# Altium schematic sheet 03_MOS_Drive.SchDoc
size A3
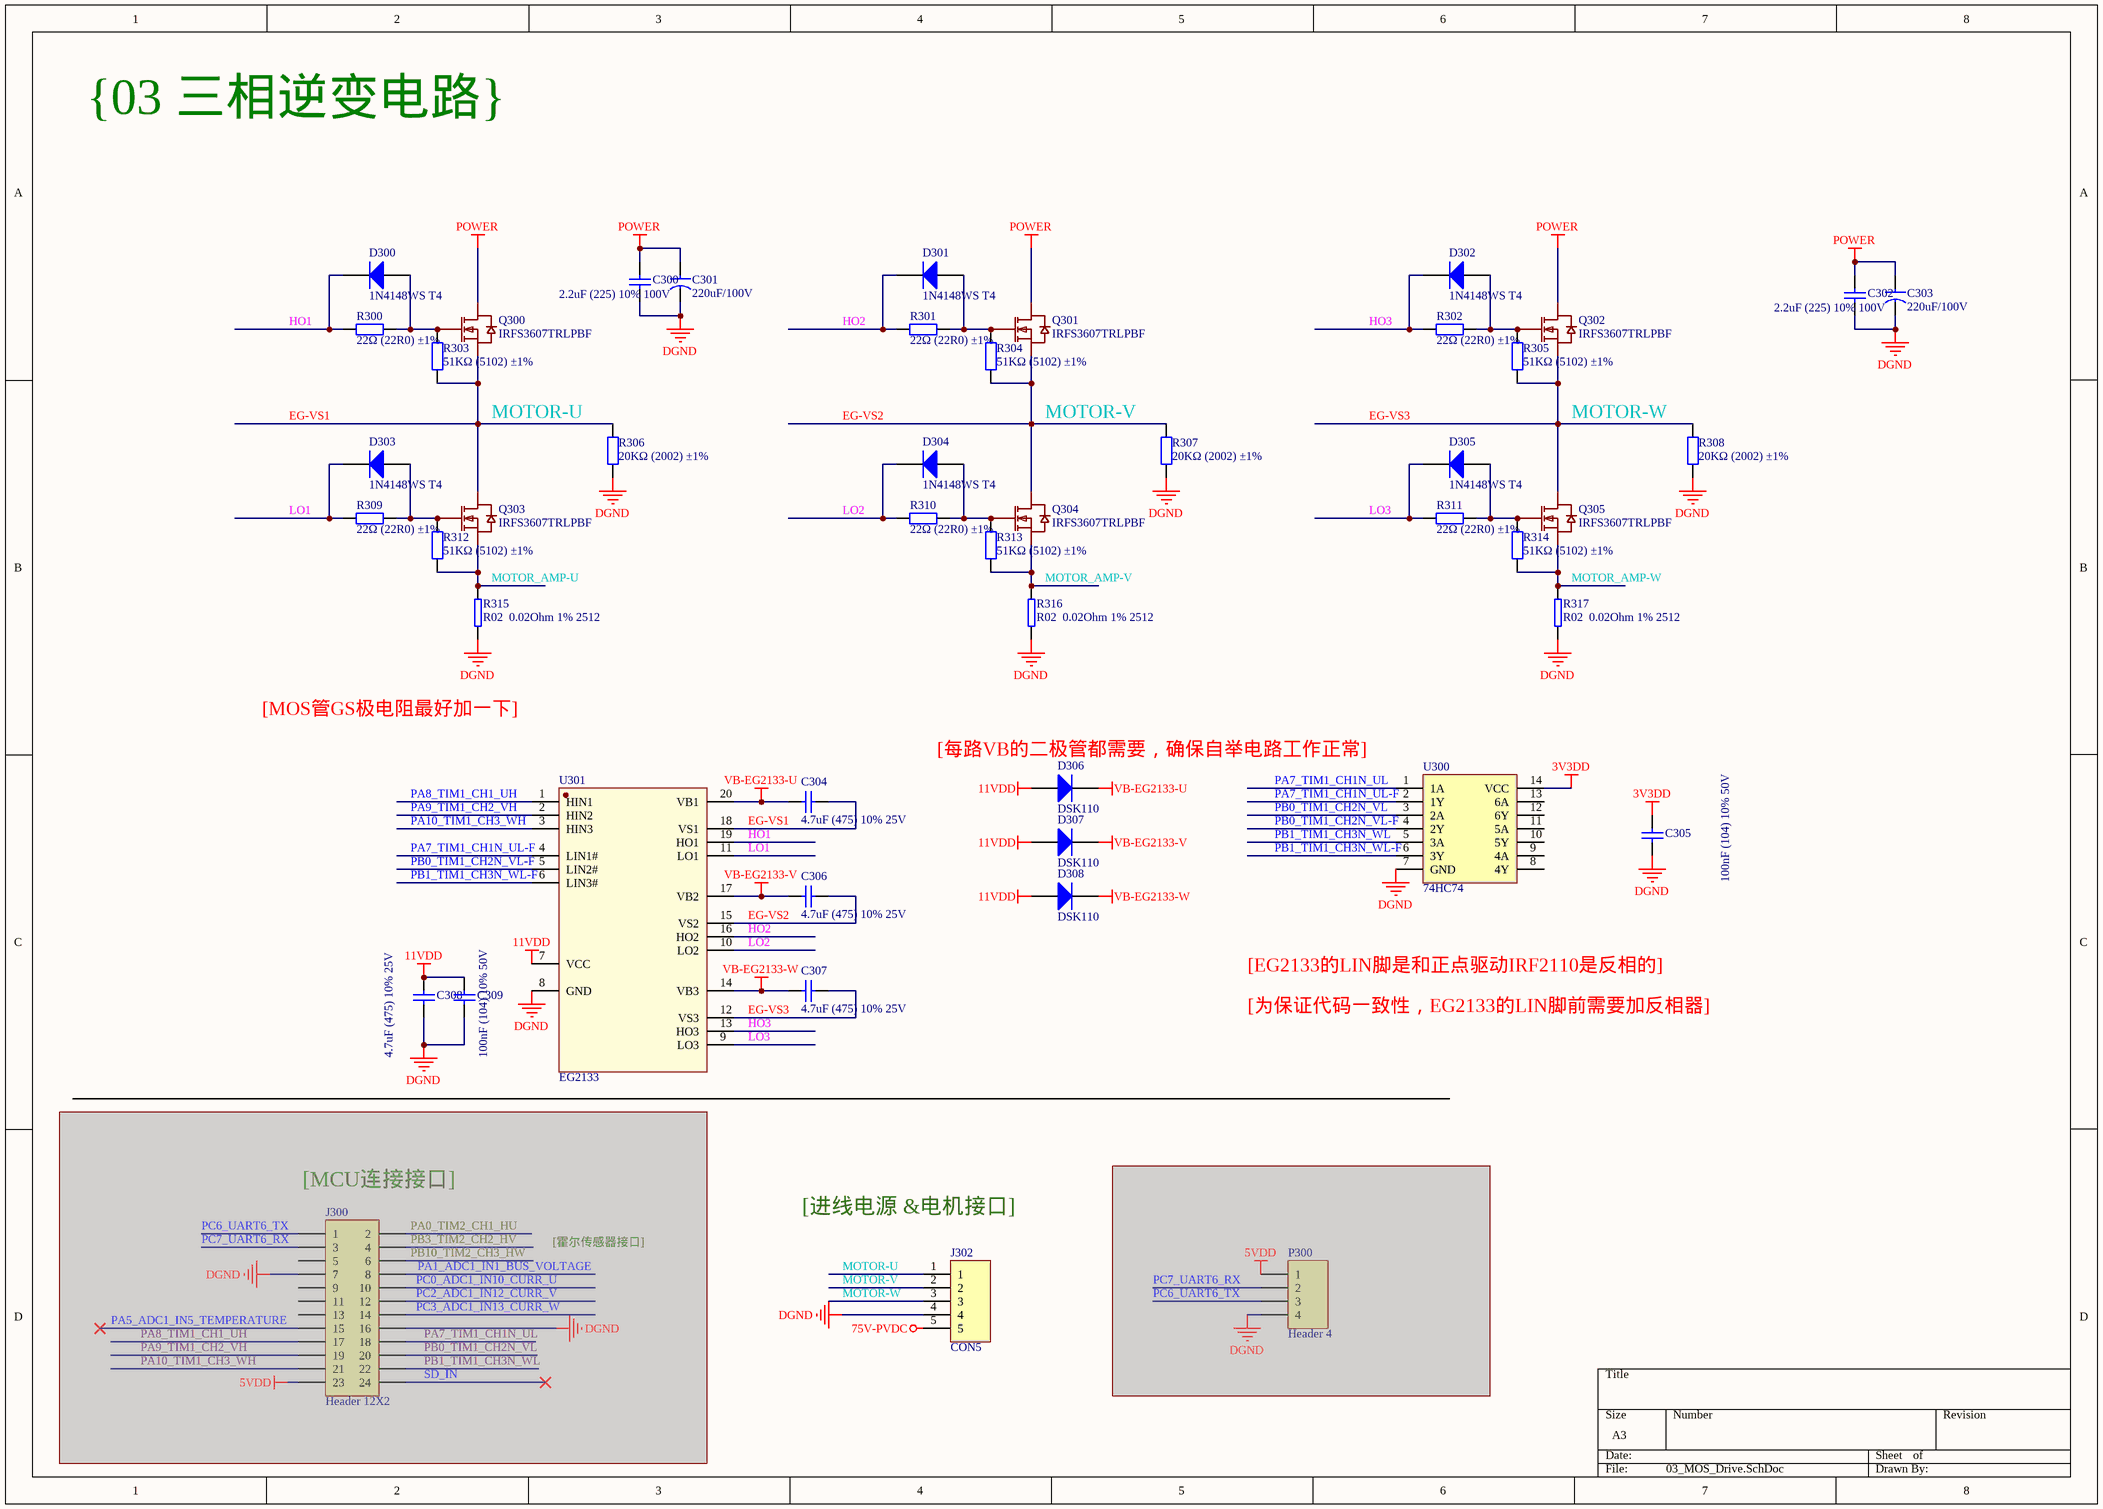
[diagram p0: 03_MOS_Drive.SchDoc]

## Parts
C300  2.2uF (225) 10% 100V  [LC-1206_C]
C301  220uF/100V  [220UF/100V]
C302  2.2uF (225) 10% 100V  [LC-1206_C]
C303  220uF/100V  [220UF/100V]
C304  4.7uF (475) 10% 25V  [LC-0805_C]
C305  100nF (104) 10% 50V  [LC-0603_C]
C306  4.7uF (475) 10% 25V  [LC-0805_C]
C307  4.7uF (475) 10% 25V  [LC-0805_C]
C308  4.7uF (475) 10% 25V  [LC-0603_C]
C309  100nF (104) 10% 50V  [LC-0603_C]
D300  1N4148WS T4  [LC-SOD-323]
D301  1N4148WS T4  [LC-SOD-323]
D302  1N4148WS T4  [LC-SOD-323]
D303  1N4148WS T4  [LC-SOD-323]
D304  1N4148WS T4  [LC-SOD-323]
D305  1N4148WS T4  [LC-SOD-323]
D306  DSK110  [DSK110]
D307  DSK110  [DSK110]
D308  DSK110  [DSK110]
J300  Header 12X2  [HDR2X12]  (masked out: inside a compile mask, not in the netlist)
J302  CON5  [7.62-5P 端子]
P300  Header 4  [HDR1X4]  (masked out: inside a compile mask, not in the netlist)
Q300  IRFS3607TRLPBF  [TO-263-2]
Q301  IRFS3607TRLPBF  [TO-263-2]
Q302  IRFS3607TRLPBF  [TO-263-2]
Q303  IRFS3607TRLPBF  [TO-263-2]
Q304  IRFS3607TRLPBF  [TO-263-2]
Q305  IRFS3607TRLPBF  [TO-263-2]
R300  22Ω (22R0) ±1%  [LC-0603_R]
R301  22Ω (22R0) ±1%  [LC-0603_R]
R302  22Ω (22R0) ±1%  [LC-0603_R]
R303  51KΩ (5102) ±1%  [LC-0603_R]
R304  51KΩ (5102) ±1%  [LC-0603_R]
R305  51KΩ (5102) ±1%  [LC-0603_R]
R306  20KΩ (2002) ±1%  [LC-0603_R]
R307  20KΩ (2002) ±1%  [LC-0603_R]
R308  20KΩ (2002) ±1%  [LC-0603_R]
R309  22Ω (22R0) ±1%  [LC-0603_R]
R310  22Ω (22R0) ±1%  [LC-0603_R]
R311  22Ω (22R0) ±1%  [LC-0603_R]
R312  51KΩ (5102) ±1%  [LC-0603_R]
R313  51KΩ (5102) ±1%  [LC-0603_R]
R314  51KΩ (5102) ±1%  [LC-0603_R]
R315  R02  0.02Ohm 1% 2512  [R2512]
R316  R02  0.02Ohm 1% 2512  [R2512]
R317  R02  0.02Ohm 1% 2512  [R2512]
U300  74HC74  [SOIC-14]
U301  EG2133  [TSSOP20]

## Nets
3V3DD: C305.2 U300.14(VCC)
11VDD: C308.2 C309.2 D306.2(A) D307.2(A) D308.2(A) U301.7(VCC)
75V-PVDC: J302.5
DGND: C300.2 C301.2 C302.2 C303.2 C305.1 C308.1 C309.1 J302.4 R306.1 R307.1 R308.1 R315.1 R316.1 R317.1 U300.7(GND) U301.8(GND)
POWER: C300.1 C301.1 C302.1 C303.1 Q300.4(D) Q301.4(D) Q302.4(D)
VB-EG2133-U: C304.1 D306.1(K) U301.20(VB1)
VB-EG2133-V: C306.1 D307.1(K) U301.17(VB2)
VB-EG2133-W: C307.1 D308.1(K) U301.14(VB3)
EG-VS1: C304.2 J302.1 Q300.3(S) Q303.4(D) R303.1 R306.2 U301.18(VS1)  [also labelled MOTOR-U]
EG-VS2: C306.2 J302.2 Q301.3(S) Q304.4(D) R304.1 R307.2 U301.15(VS2)  [also labelled MOTOR-V]
EG-VS3: C307.2 J302.3 Q302.3(S) Q305.4(D) R305.1 R308.2 U301.12(VS3)  [also labelled MOTOR-W]
HO1: D300.2(K) R300.1 U301.19(HO1)
HO2: D301.2(K) R301.1 U301.16(HO2)
HO3: D302.2(K) R302.1 U301.13(HO3)
LO1: D303.2(K) R309.1 U301.11(LO1)
LO2: D304.2(K) R310.1 U301.10(LO2)
LO3: D305.2(K) R311.1 U301.9(LO3)
MOTOR_AMP-U: Q303.3(S) R312.1 R315.2
MOTOR_AMP-V: Q304.3(S) R313.1 R316.2
MOTOR_AMP-W: Q305.3(S) R314.1 R317.2
PA7_TIM1_CH1N_UL: U300.1(1A)
PA7_TIM1_CH1N_UL-F: U300.2(1Y) U301.4(LIN1#)
PA8_TIM1_CH1_UH: U301.1(HIN1)
PA9_TIM1_CH2_VH: U301.2(HIN2)
PA10_TIM1_CH3_WH: U301.3(HIN3)
PB0_TIM1_CH2N_VL: U300.3(2A)
PB0_TIM1_CH2N_VL-F: U300.4(2Y) U301.5(LIN2#)
PB1_TIM1_CH3N_WL: U300.5(3A)
PB1_TIM1_CH3N_WL-F: U300.6(3Y) U301.6(LIN3#)
NetD300_1: D300.1(A) Q300.1(G) R300.2 R303.2
NetD301_1: D301.1(A) Q301.1(G) R301.2 R304.2
NetD302_1: D302.1(A) Q302.1(G) R302.2 R305.2
NetD303_1: D303.1(A) Q303.1(G) R309.2 R312.2
NetD304_1: D304.1(A) Q304.1(G) R310.2 R313.2
NetD305_1: D305.1(A) Q305.1(G) R311.2 R314.2

Not connected (* = marked no-connect by the designer): U300 8(4Y) 9(4A) 10(5Y) 11(5A) 12(6Y) 13(6A)

## Notes on the sheet
- {03 三相逆变电路}
- [MOS管GS极电阻最好加一下]
- (near D306) [每路VB的二极管都需要，确保自举电路工作正常]
- [EG2133的LIN脚是和正点驱动IRF2110是反相的]
- [为保证代码一致性，EG2133的LIN脚前需要加反相器]
- (near J300) [MCU连接接口]
- [霍尔传感器接口]
- [进线电源 &电机接口]

## Library data of the parts
C300 C302 = 1206 2.2uF (225) 10% 50V: 贴片电容; ComponentLink1Description: 供应商链接; ComponentLink1URL: http://www.szlcsc.com/product/details_13292.html; Package: 1206; Supplier: LC; SuppliersPartNumber: C12656
C301 C303 = CapSMT220u_16V
C304 C306 C307 = 0805 4.7uF (475) 10% 25V: 贴片电容; ComponentLink1Description: 供应商链接; ComponentLink1URL: http://www.szlcsc.com/product/details_2131.html; Package: 0805; Supplier: LC; SuppliersPartNumber: C1779
C305 C309 = 0603 100nF (104) 10% 50V: 贴片电容; ComponentLink1Description: 供应商链接; ComponentLink1URL: http://www.szlcsc.com/product/details_15331.html; Package: 0603; Supplier: LC; SuppliersPartNumber: C14663
C308 = 0603 4.7uF (475) 10% 16V: 贴片电容; ComponentLink1Description: 供应商链接; ComponentLink1URL: http://www.szlcsc.com/product/details_20375.html; Package: 0603; Supplier: LC; SuppliersPartNumber: C19666
D300-D305 = SOD-323 1N4148WS T4: 二极管; ComponentLink1Description: 供应商链接; ComponentLink1URL: http://www.szlcsc.com/product/details_2485.html; Package: SOD-323; Supplier: LC; SuppliersPartNumber: C2128
D306-D308 = SMA(DO-214AC) SS54: 二极管; ComponentLink1Description: 供应商链接; ComponentLink1URL: http://www.szlcsc.com/product/details_23178.html; Package: SMA(DO-214AC); Supplier: LC; SuppliersPartNumber: C22452
J300 = Header 12X2: Header, 12-Pin, Dual row; LatestRevisionDate: 17-Jul-2002; LatestRevisionNote: Re-released for DXP Platform.; Publisher: Altium Limited
P300 = Header 4: Header, 4-Pin; LatestRevisionDate: 17-Jul-2002; LatestRevisionNote: Re-released for DXP Platform.; Publisher: Altium Limited
R300-R302 R309-R311 = 0603 22Ω (22R0) 1%: 贴片电阻; ComponentLink1Description: 供应商链接; ComponentLink1URL: http://www.szlcsc.com/product/details_24078.html; Package: 0603; Supplier: LC; SuppliersPartNumber: C23345
R303-R305 R312-R314 = 0603 51KΩ (5102) 1%: 贴片电阻; ComponentLink1Description: 供应商链接; ComponentLink1URL: http://www.szlcsc.com/product/details_23923.html; Package: 0603; Supplier: LC; SuppliersPartNumber: C23196
R306-R308 = 0603 20KΩ (2002) 1%: 贴片电阻; ComponentLink1Description: 供应商链接; ComponentLink1URL: http://www.szlcsc.com/product/details_4591.html; Package: 0603; Supplier: LC; SuppliersPartNumber: C4184
R315-R317 = Res10K
U300 = 74HC14